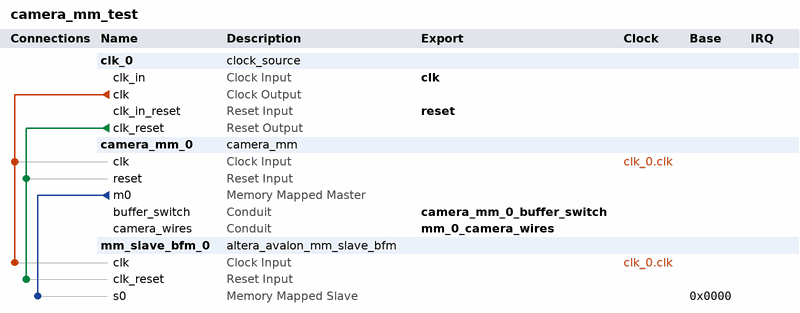
[diagram p0: system contents]
# Platform Designer (Qsys) system camera_mm_test, Cyclone IV GX EP4CGX150DF31C7
# Parameters at their usual value, and those the tool derives, are not listed.
package require -exact qsys 15.0
create_system camera_mm_test
set_project_property DEVICE_FAMILY {Cyclone IV GX}
set_project_property DEVICE EP4CGX150DF31C7

add_instance clk_0 clock_source 15.0
set_instance_parameter_value clk_0 clockFrequency 50000000

add_instance camera_mm_0 camera_mm 1.0

add_instance mm_slave_bfm_0 altera_avalon_mm_slave_bfm 15.0
set_instance_parameter_value mm_slave_bfm_0 ADDRESS_UNITS WORDS
set_instance_parameter_value mm_slave_bfm_0 ASSERT_HIGH_ARBITERLOCK 1
set_instance_parameter_value mm_slave_bfm_0 ASSERT_HIGH_BYTEENABLE 1
set_instance_parameter_value mm_slave_bfm_0 ASSERT_HIGH_LOCK 1
set_instance_parameter_value mm_slave_bfm_0 ASSERT_HIGH_READ 1
set_instance_parameter_value mm_slave_bfm_0 ASSERT_HIGH_READDATAVALID 1
set_instance_parameter_value mm_slave_bfm_0 ASSERT_HIGH_RESET 1
set_instance_parameter_value mm_slave_bfm_0 ASSERT_HIGH_WAITREQUEST 1
set_instance_parameter_value mm_slave_bfm_0 ASSERT_HIGH_WRITE 1
set_instance_parameter_value mm_slave_bfm_0 AV_ADDRESS_W 25
set_instance_parameter_value mm_slave_bfm_0 AV_BURSTCOUNT_W 3
set_instance_parameter_value mm_slave_bfm_0 AV_BURST_BNDR_ONLY 1
set_instance_parameter_value mm_slave_bfm_0 AV_BURST_LINEWRAP 1
set_instance_parameter_value mm_slave_bfm_0 AV_FIX_READ_LATENCY 0
set_instance_parameter_value mm_slave_bfm_0 AV_MAX_PENDING_READS 1
set_instance_parameter_value mm_slave_bfm_0 AV_MAX_PENDING_WRITES 0
set_instance_parameter_value mm_slave_bfm_0 AV_NUMSYMBOLS 4
set_instance_parameter_value mm_slave_bfm_0 AV_READRESPONSE_W 8
set_instance_parameter_value mm_slave_bfm_0 AV_READ_WAIT_TIME 1
set_instance_parameter_value mm_slave_bfm_0 AV_REGISTERINCOMINGSIGNALS 0
set_instance_parameter_value mm_slave_bfm_0 AV_SYMBOL_W 8
set_instance_parameter_value mm_slave_bfm_0 AV_WRITERESPONSE_W 8
set_instance_parameter_value mm_slave_bfm_0 AV_WRITE_WAIT_TIME 0
set_instance_parameter_value mm_slave_bfm_0 REGISTER_WAITREQUEST 0
set_instance_parameter_value mm_slave_bfm_0 USE_ADDRESS 1
set_instance_parameter_value mm_slave_bfm_0 USE_ARBITERLOCK 0
set_instance_parameter_value mm_slave_bfm_0 USE_BEGIN_BURST_TRANSFER 0
set_instance_parameter_value mm_slave_bfm_0 USE_BEGIN_TRANSFER 0
set_instance_parameter_value mm_slave_bfm_0 USE_BURSTCOUNT 0
set_instance_parameter_value mm_slave_bfm_0 USE_BYTE_ENABLE 0
set_instance_parameter_value mm_slave_bfm_0 USE_CLKEN 0
set_instance_parameter_value mm_slave_bfm_0 USE_DEBUGACCESS 0
set_instance_parameter_value mm_slave_bfm_0 USE_LOCK 1
set_instance_parameter_value mm_slave_bfm_0 USE_READ 0
set_instance_parameter_value mm_slave_bfm_0 USE_READRESPONSE 0
set_instance_parameter_value mm_slave_bfm_0 USE_READ_DATA 0
set_instance_parameter_value mm_slave_bfm_0 USE_READ_DATA_VALID 0
set_instance_parameter_value mm_slave_bfm_0 USE_TRANSACTIONID 0
set_instance_parameter_value mm_slave_bfm_0 USE_WAIT_REQUEST 1
set_instance_parameter_value mm_slave_bfm_0 USE_WRITE 1
set_instance_parameter_value mm_slave_bfm_0 USE_WRITERESPONSE 0
set_instance_parameter_value mm_slave_bfm_0 USE_WRITE_DATA 1
set_instance_parameter_value mm_slave_bfm_0 VHDL_ID 0

# connections
add_connection clk_0.clk camera_mm_0.clk clock
add_connection clk_0.clk mm_slave_bfm_0.clk clock
add_connection clk_0.clk_reset camera_mm_0.reset reset
add_connection clk_0.clk_reset mm_slave_bfm_0.clk_reset reset
add_connection camera_mm_0.m0 mm_slave_bfm_0.s0 avalon
set_connection_parameter_value camera_mm_0.m0/mm_slave_bfm_0.s0 baseAddress 0x0000

# exported interfaces
add_interface camera_mm_0_buffer_switch conduit end
set_interface_property camera_mm_0_buffer_switch EXPORT_OF camera_mm_0.buffer_switch
add_interface clk clock sink
set_interface_property clk EXPORT_OF clk_0.clk_in
add_interface mm_0_camera_wires conduit end
set_interface_property mm_0_camera_wires EXPORT_OF camera_mm_0.camera_wires
add_interface reset reset sink
set_interface_property reset EXPORT_OF clk_0.clk_in_reset

set_interconnect_requirement {$system} qsys_mm.clockCrossingAdapter HANDSHAKE
set_interconnect_requirement {$system} qsys_mm.enableEccProtection FALSE
set_interconnect_requirement {$system} qsys_mm.insertDefaultSlave FALSE
set_interconnect_requirement {$system} qsys_mm.maxAdditionalLatency 1

save_system camera_mm_test.qsys
